# EAGLE design proj1 (EAGLE 9.6.2)
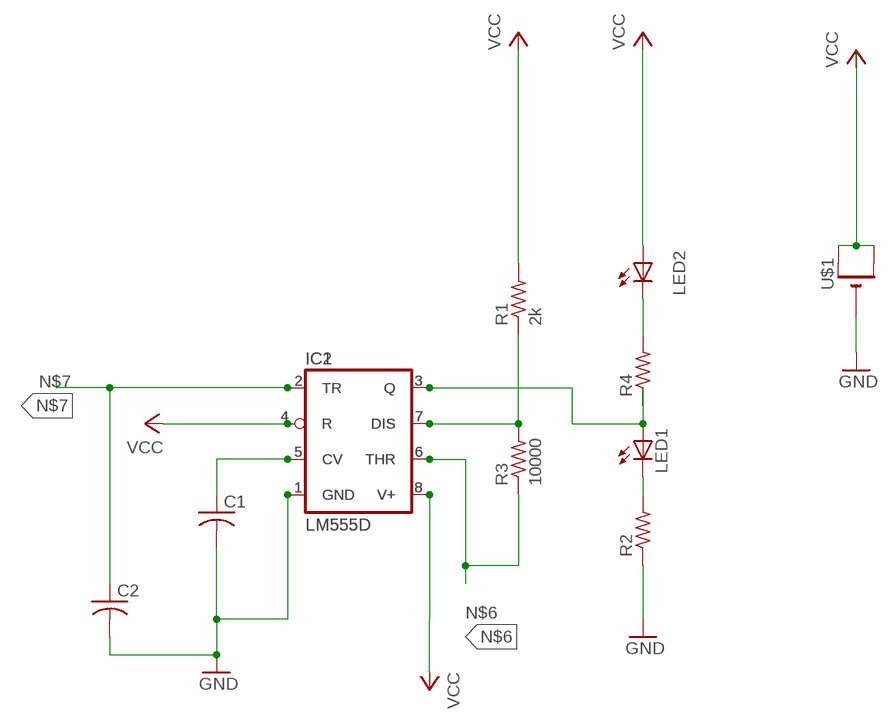
[diagram p0: schematic, sheet 1]

## Parts
C1  C-USC0805  [C0805]
C2  C-USC0805  [C0805]
IC1  LM555D  [SO08]
IC2  LM555D  [SO08]
LED1  LEDCHIPLED_0805  [CHIPLED_0805]
LED2  LEDCHIPLED_0805  [CHIPLED_0805]
R1  2k  R-US_M0805  [M0805]
R2  R-US_M0805  [M0805]
R3  10000  R-US_M0805  [M0805]
R4  R-US_M0805  [M0805]
U$1  CR1220SMT  [CR1220-SMD]

## Nets
GND: C1.2 C2.2 IC1.1(GND) IC2.1(GND) R2.1 U$1.-
N$1: LED2.C R4.2
N$2: IC1.3(Q) IC2.3(Q) LED1.A R4.1
N$3: LED1.C R2.2
N$4: C1.1 IC1.5(CV) IC2.5(CV)
N$5: IC1.7(DIS) IC2.7(DIS) R1.1 R3.2
N$6: IC1.6(THR) IC2.6(THR) R3.1
N$7: C2.1 IC1.2(TR) IC2.2(TR)
N$8: IC1.8(V+) IC2.8(V+) ; supply symbol labelled VCC
VCC: IC1.4(R) IC2.4(R) LED2.A R1.2 U$1.+$1(+) U$1.+$2(+1)

## Library data of the parts
C1 C2 = adafruit:C-US: CAPACITOR, American symbol
IC1 IC2 = adafruit:*555: TIMER Changed DIP package to have round (not oval) pin pads http://www.ladyada.net/library/pcb/eaglelibrary.html
LED1 LED2 = adafruit:LED: LED OSRAM: - CHIPLED LG R971, LG N971, LY N971, LG Q971, LY Q971, LO R971, LY R971 LH N974, LH R974 LS Q976, LO Q976, LY Q976 LO Q996 - Hyper CHIPLED LW Q18S LB Q993, LB Q99A, LB R99A - SideLED LS A670, LO A670, LY A670, LG A670, LP A670 LB A673, LV A673, LT A673, LW A673 LH A674 LY A675 LS A676, LA A676, LO A676, LY A676, LW A676 LS A679, LY A679, LG A679 - Hyper Micro SIDELED® LS Y876, LA Y876, LO Y876, LY Y876 LT Y87S - SmartLED LW L88C, LW L88S LB L89C, LB L89S, LG L890 LS L89K, LO L89K, LY L89K LS L896, LA L896, LO L896, LY L896 - TOPLED LS T670, LO T670, LY T670, LG T670, LP T670 LSG T670, LSP T670, LSY T670, LOP T670, LYG T670 LG T671, LOG T671, LSG T671 LB T673, LV T673, LT T673, LW T673 LH T674 LS T676, LA T676, LO T676, LY T676, LB T676, LH T676, LSB T676, LW T676 LB T67C, LV T67C, LT T67C, LS T67K, LO T67K, LY T67K, LW E67C LS E67B, LA E67B, LO E67B, LY E67B, LB E67C, LV E67C, LT E67C LW T67C LS T679, LY T679, LG T679 LS T770, LO T770, LY T770, LG T770, LP T770 LB T773, LV T773, LT T773, LW T773 LH T774 LS E675, LA E675, LY E675, LS T675 LS T776, LA T776, LO T776, LY T776, LB T776 LHGB T686 LT T68C, LB T68C - Hyper Mini TOPLED® LB M676 - Mini TOPLED Santana® LG M470 LS M47K, LO M47K, LY M47K Source: http://www.osram.convergy.de/
R1-R4 = adafruit:R-US_: RESISTOR, American symbol
U$1 = adafruit:CR1220: CR1216/CR1220/CR1225 12mm 3V lithium coin cell Great for battery packup. Both SMT and THM holders. Note the THM package has the ground pads on both sides of the PCB so that the masks are the same - this reduces the cost

## Board
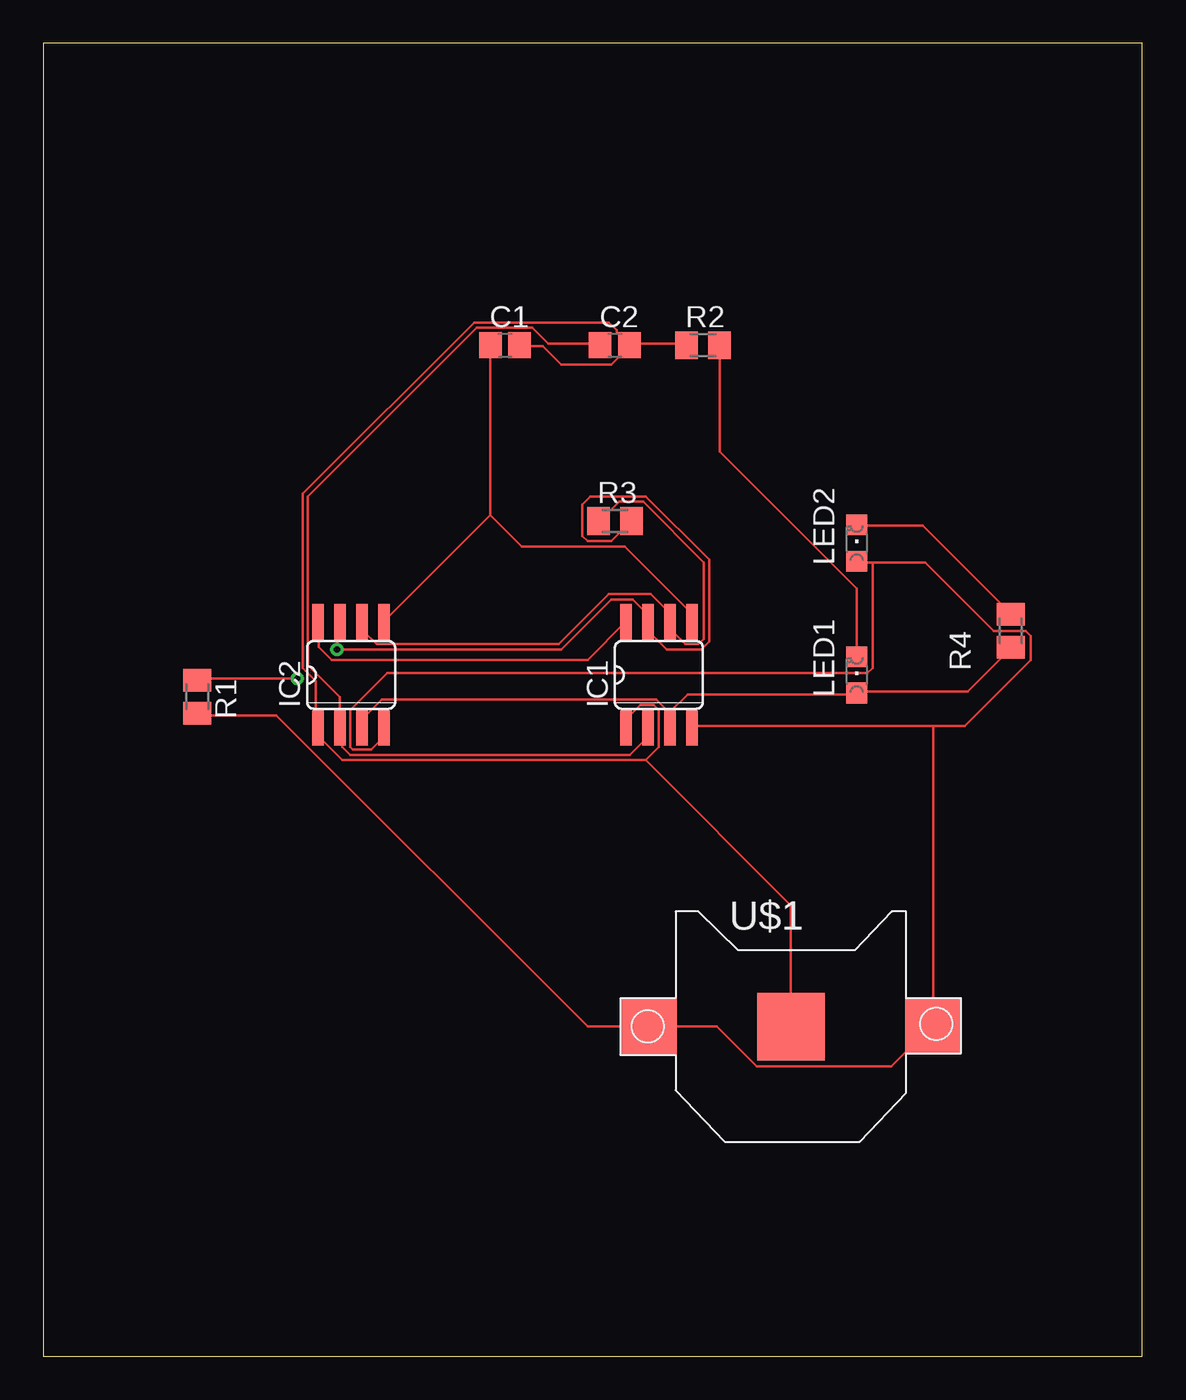
[diagram p1: board, top side]
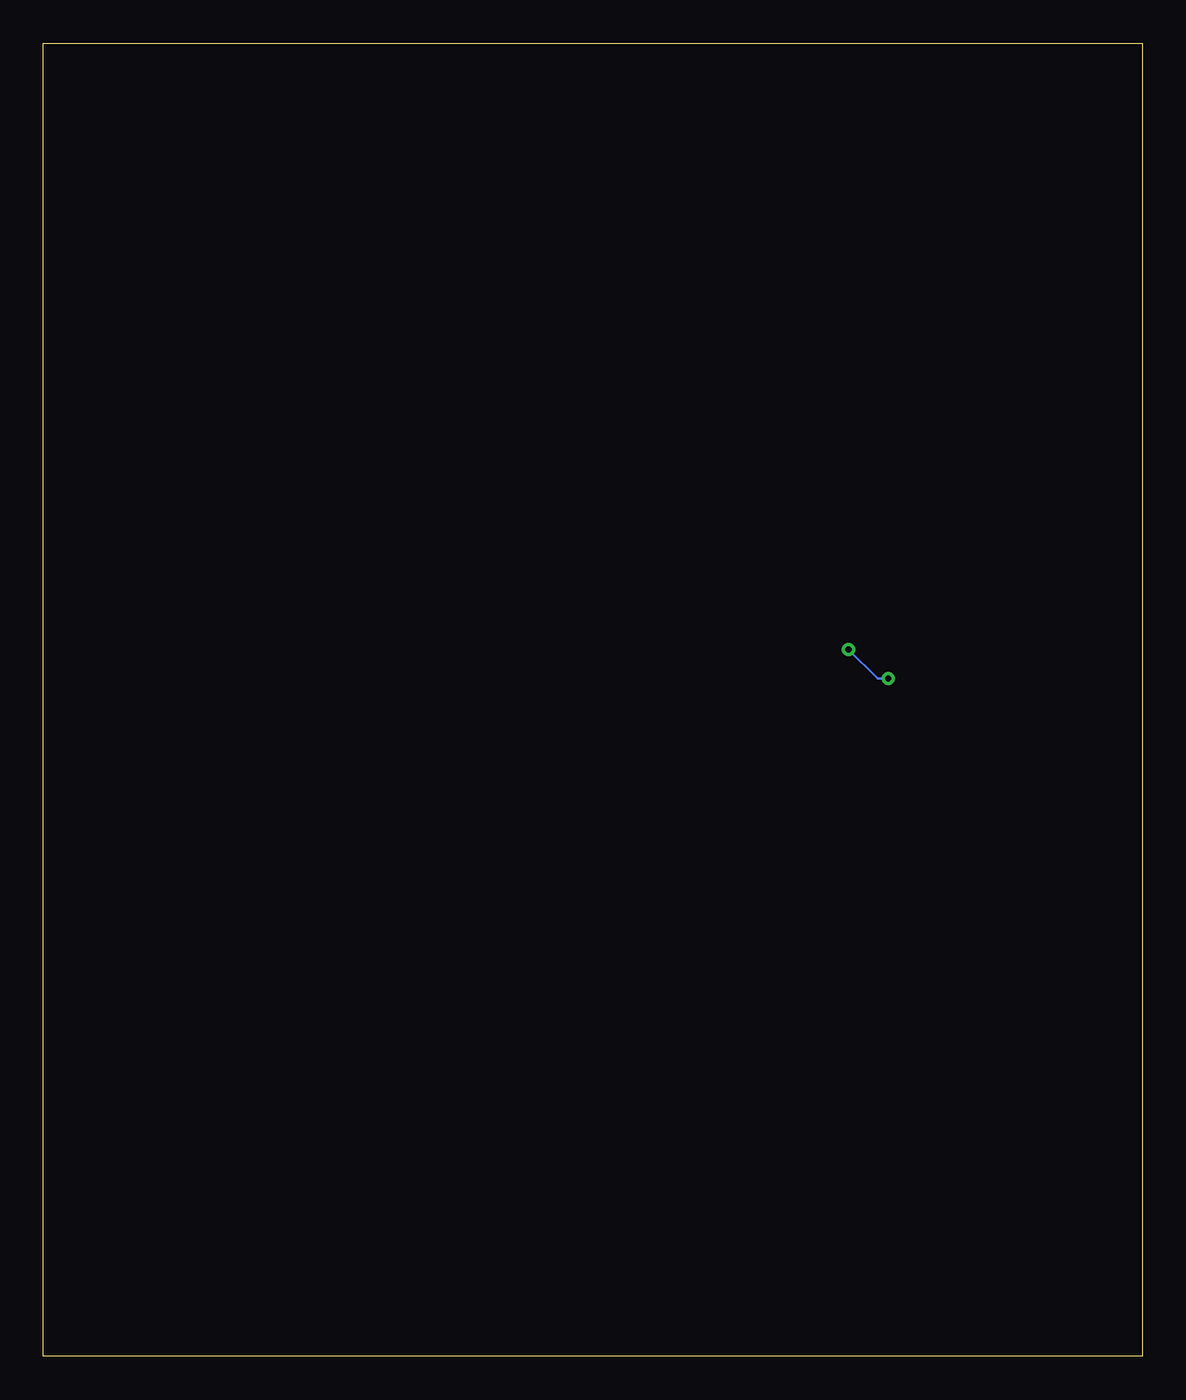
[diagram p2: board, bottom side, seen from below]

Size 63.48 x 75.87 mm. Coordinates in mm from the lower left corner, seen from the top.
Outline: 0,0 63.48,0 63.48,75.87 0,75.87 0,0
Copper layers (1*16): Top 0.035mm / dielectric 1.5mm / Bottom 0.035mm
Design rules "default": minimum track width 6mil, minimum drill 0.35mm, track to track 6mil, track to pad 6mil, pad to pad 6mil, via to via 6mil, smd to smd 6mil, copper to edge 40mil, drill to drill 6mil, minimum pad ring 10mil, minimum via ring 8mil, stop-mask expansion 4mil, vias tented up to drill 0mil, thermal gap 10mil

### Footprints (pad centres in the part's own frame; a part is rotated, then mirrored left to right if it is on the bottom)
C0805 = smd 1.3 x 1.5: 1 -0.85,0; 2 0.85,0
SO08 = smd 0.66 x 2.032: 1 -1.905,-3.073; 2 -0.635,-3.073; 3 0.635,-3.073; 4 1.905,-3.073; 5 1.905,3.073; 6 0.635,3.073; 7 -0.635,3.073; 8 -1.905,3.073
CHIPLED_0805 = smd 1.2 x 1.2: A 0,-1.05; C 0,1.05
M0805 = smd 1.3 x 1.6: 1 -0.95,0; 2 0.95,0
CR1220-SMD = smd 3.2 x 3.2: +$1 -8.2,0; +$2 8.2,0 | smd 3.9 x 3.9: - 0,0

### Placement (x,y rotation side)
C1  26.67,58.42 0 top
C2  33.02,58.42 0 top
IC1  35.56,39.37 0 top
IC2  17.78,39.37 0 top
LED1  46.99,39.37 0 top
LED2  46.99,46.99 0 top
R1  8.89,38.1 270 top
R2  38.1,58.42 0 top
R3  33.02,48.26 0 top
R4  55.88,41.91 90 top
U$1  43.18,19.05 0 top

### Tracks (layer width: path | path; a pad name or v marks a point on that pad's centre or on a via)
GND
  Top 0.152: C1.2 27.64,58.37 28.85,58.37 29.92,57.3 32.82,57.3 33.88,58.37 C2.2 | R2.1 37.08,58.52 33.88,58.52 C2.2 | 34.8,34.44 17.27,34.44 15.9,35.81 15.9,36.27 IC2.1 15.75,36.42 15.75,39.01 14.99,39.78 14.99,49.84 24.89,59.74 32.66,59.74 33.12,59.28 33.12,59.13 33.73,58.52 C2.2 | 34.8,34.44 35.56,35.2 35.56,37.34 35.25,37.64 34.49,37.64 33.73,36.88 33.73,36.42 IC1.1 | U$1.- 43.18,26.06 34.8,34.44
N$1
  Top 0.152: LED2.C 46.99,48.01 50.8,48.01 55.83,42.98 R4.2
N$2
  Top 0.152: R4.1 55.83,40.84 53.39,38.41 46.99,38.41 LED1.A 46.99,38.25 37.24,38.25 36.17,37.19 | 36.17,37.19 35.41,37.95 19.56,37.95 18.49,36.88 18.49,36.42 IC2.3 | 36.17,37.19 36.17,36.42 IC1.3 36.17,37.19
N$3
  Top 0.152: LED1.C 46.99,44.35 39.06,52.27 39.06,58.37 R2.2
N$4
  Top 0.152: 25.81,48.62 25.81,58.37 C1.1 | 25.81,48.62 19.71,42.52 IC2.5 | 25.81,48.62 27.64,46.79 33.58,46.79 37.39,42.98 37.39,42.52 IC1.5
N$5  (via drill 0.35)
  Top 0.152: R3.2 33.88,48.16 32.82,47.09 31.44,47.09 31.14,47.4 31.14,49.23 31.6,49.68 34.8,49.68 38.46,46.02 38.46,41.3 38,40.84 36.02,40.84 34.95,41.91 34.95,42.37 IC1.7 34.8,42.52 34.8,42.98 34.04,43.74 32.82,43.74 29.92,40.84 v16.97,40.84 16.97,42.22 17.12,42.37 IC2.7 | v14.68,39.17 8.89,39.17 R1.1
  Bottom 0.152: v14.68,39.17 15.29,39.17 v16.97,40.84
N$6
  Top 0.152: R3.1 32.21,48.31 33.27,49.38 34.65,49.38 38.15,45.87 38.15,41.45 37.85,41.15 37.08,41.15 36.32,41.91 36.32,42.37 IC1.6 36.17,42.52 36.17,42.98 35.1,44.04 32.66,44.04 29.77,41.15 19.25,41.15 18.49,41.91 18.49,42.37 IC2.6
N$7
  Top 0.152: C2.1 32.06,58.52 29.16,58.52 28.25,59.44 25.04,59.44 15.29,49.68 15.29,39.93 17.12,38.1 17.12,36.42 IC2.2 17.27,36.27 17.27,35.2 17.73,34.75 33.88,34.75 34.8,35.66 34.8,36.27 IC1.2
N$8
  Top 0.152: IC1.8 31.44,40.23 16.66,40.23 15.9,41 15.9,42.37 IC2.8
VCC
  Top 0.152: R1.2 8.89,37.03 13.46,37.03 31.44,19.05 U$1.+$1 38.91,19.05 41.2,16.76 48.97,16.76 51.26,19.05 U$1.+$2 51.41,19.05 51.41,36.42 | 47.9,45.87 50.95,45.87 54.92,41.91 56.74,41.91 57.05,41.6 57.05,40.23 53.24,36.42 51.41,36.42 | 47.9,45.87 46.99,45.87 LED2.A | 51.41,36.42 37.54,36.42 IC1.4 | 47.9,45.87 47.9,39.78 47.6,39.47 19.86,39.47 17.73,37.34 17.73,35.2 17.88,35.05 18.95,35.05 19.56,35.66 19.56,36.27 IC2.4